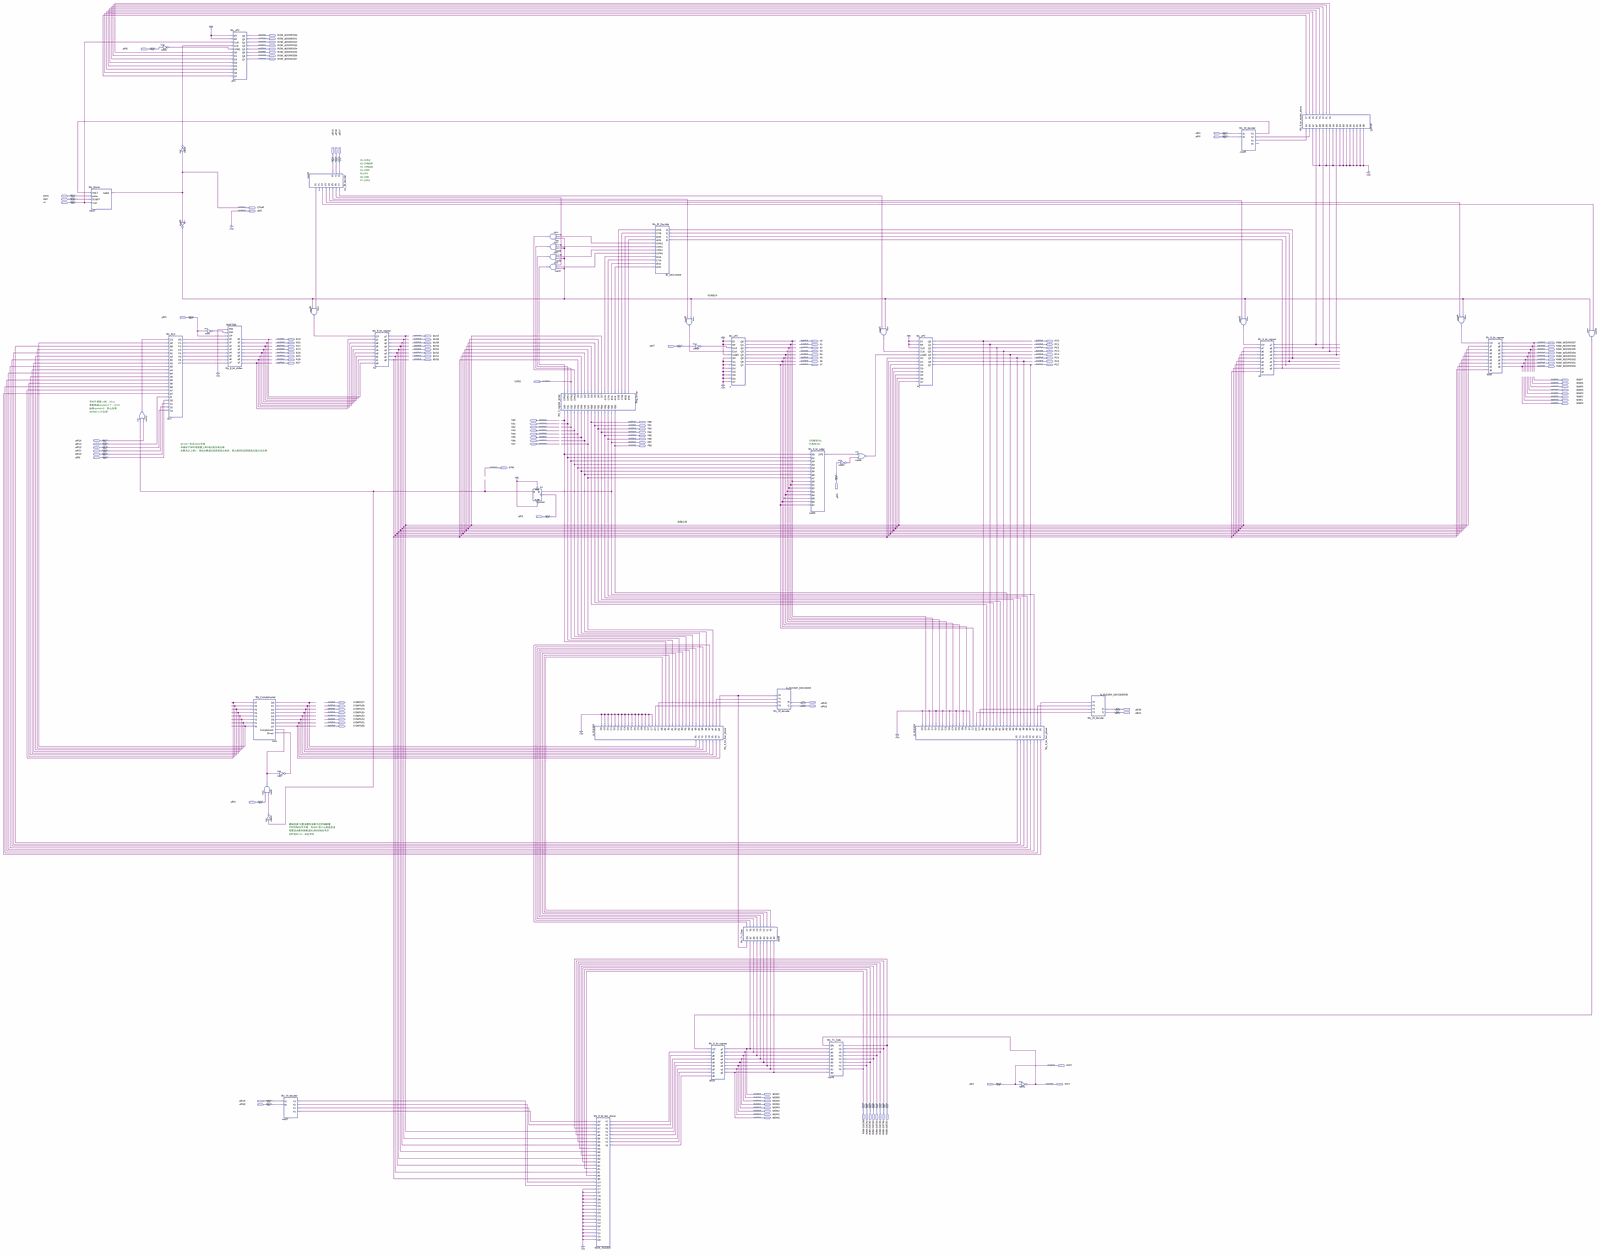
[diagram p0: schematic sheet, whole]
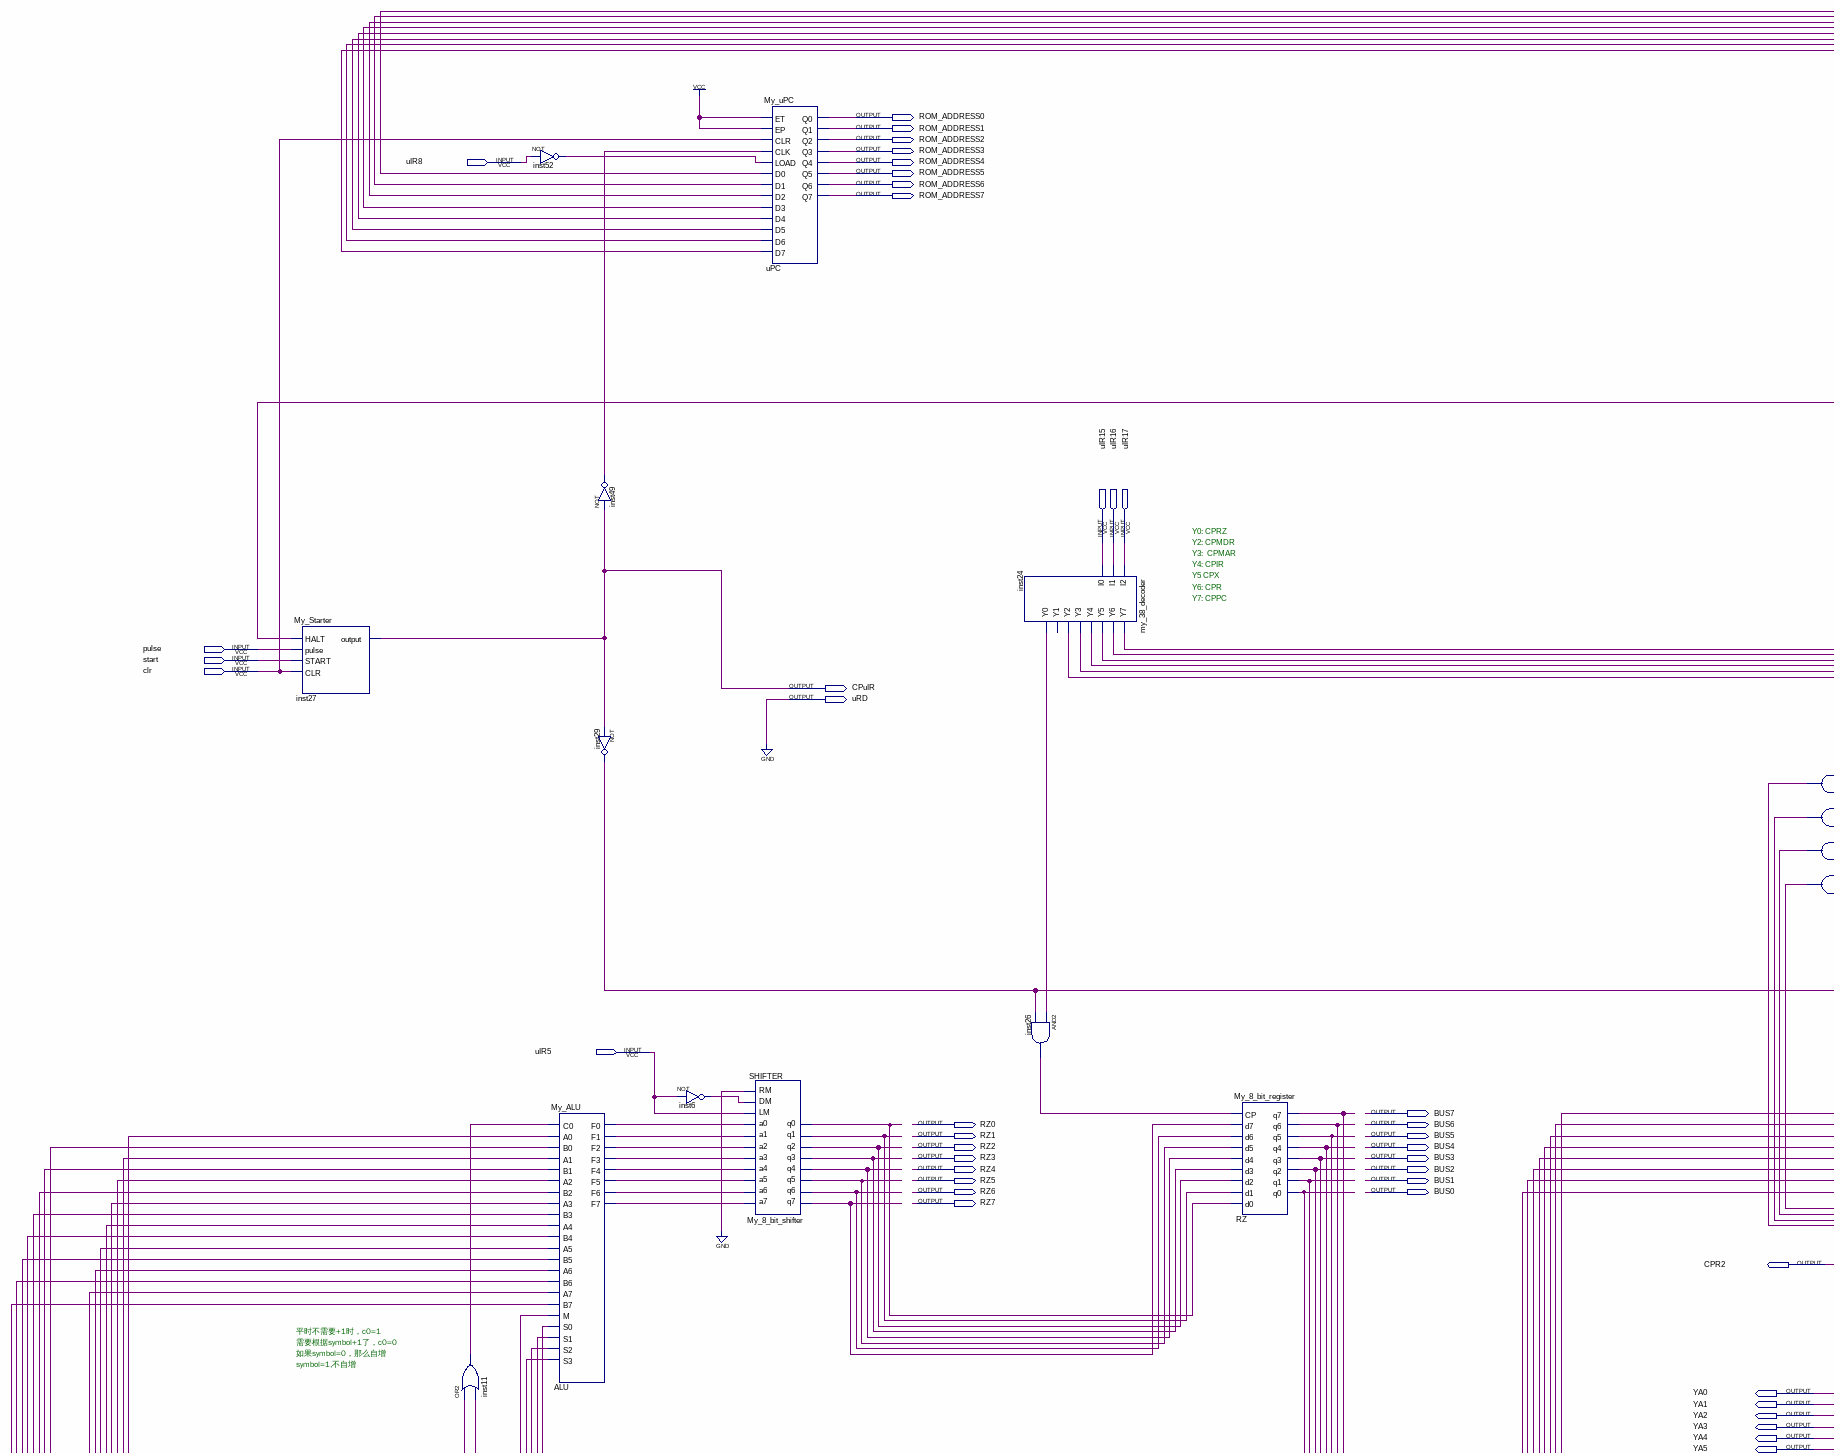
[diagram p1: schematic sheet, upper left part]
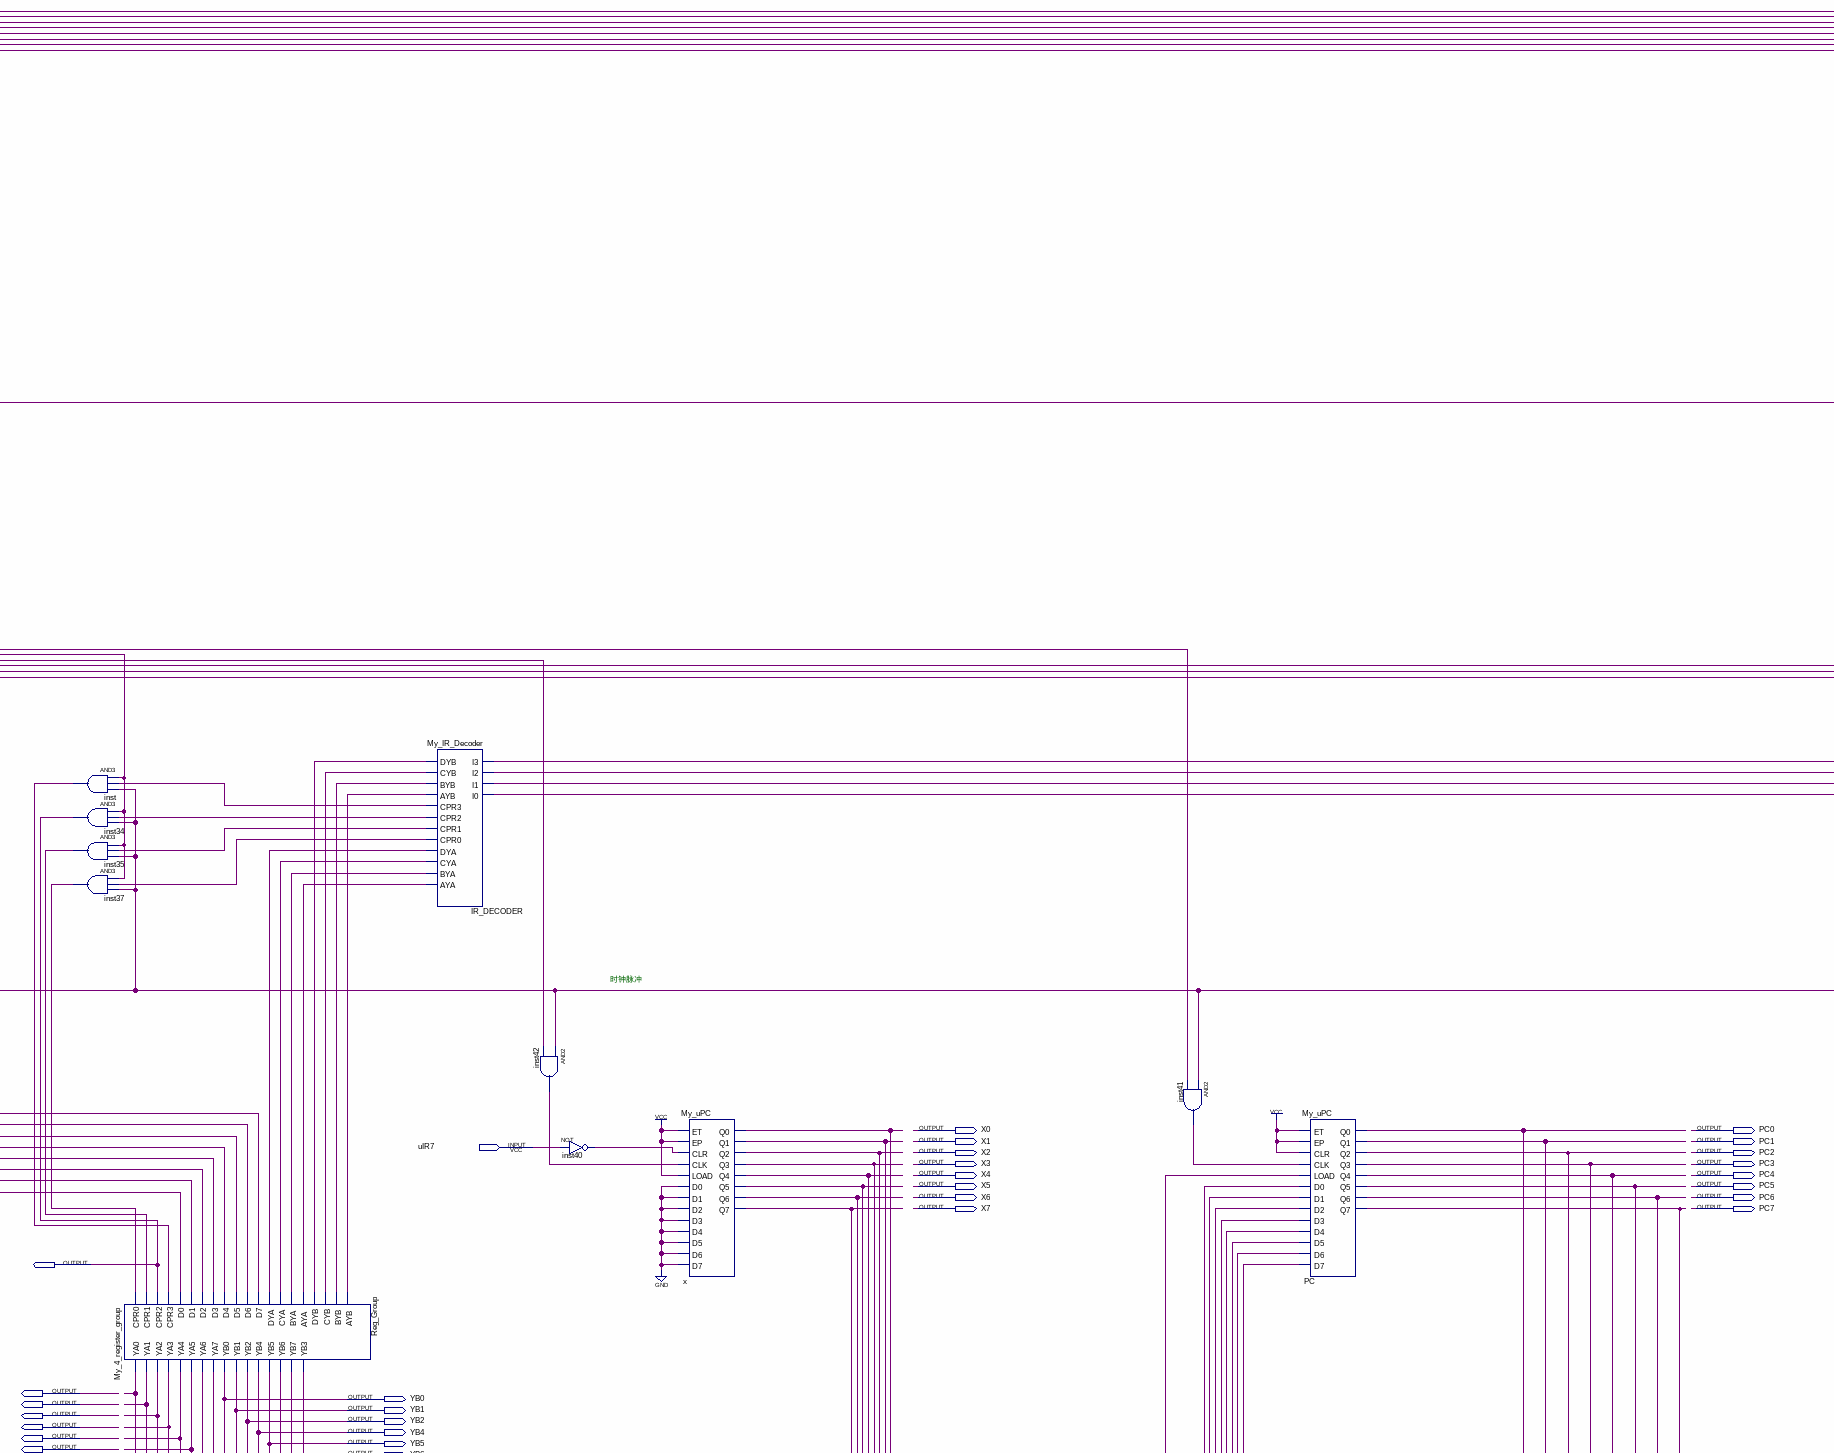
[diagram p2: schematic sheet, upper centre part]
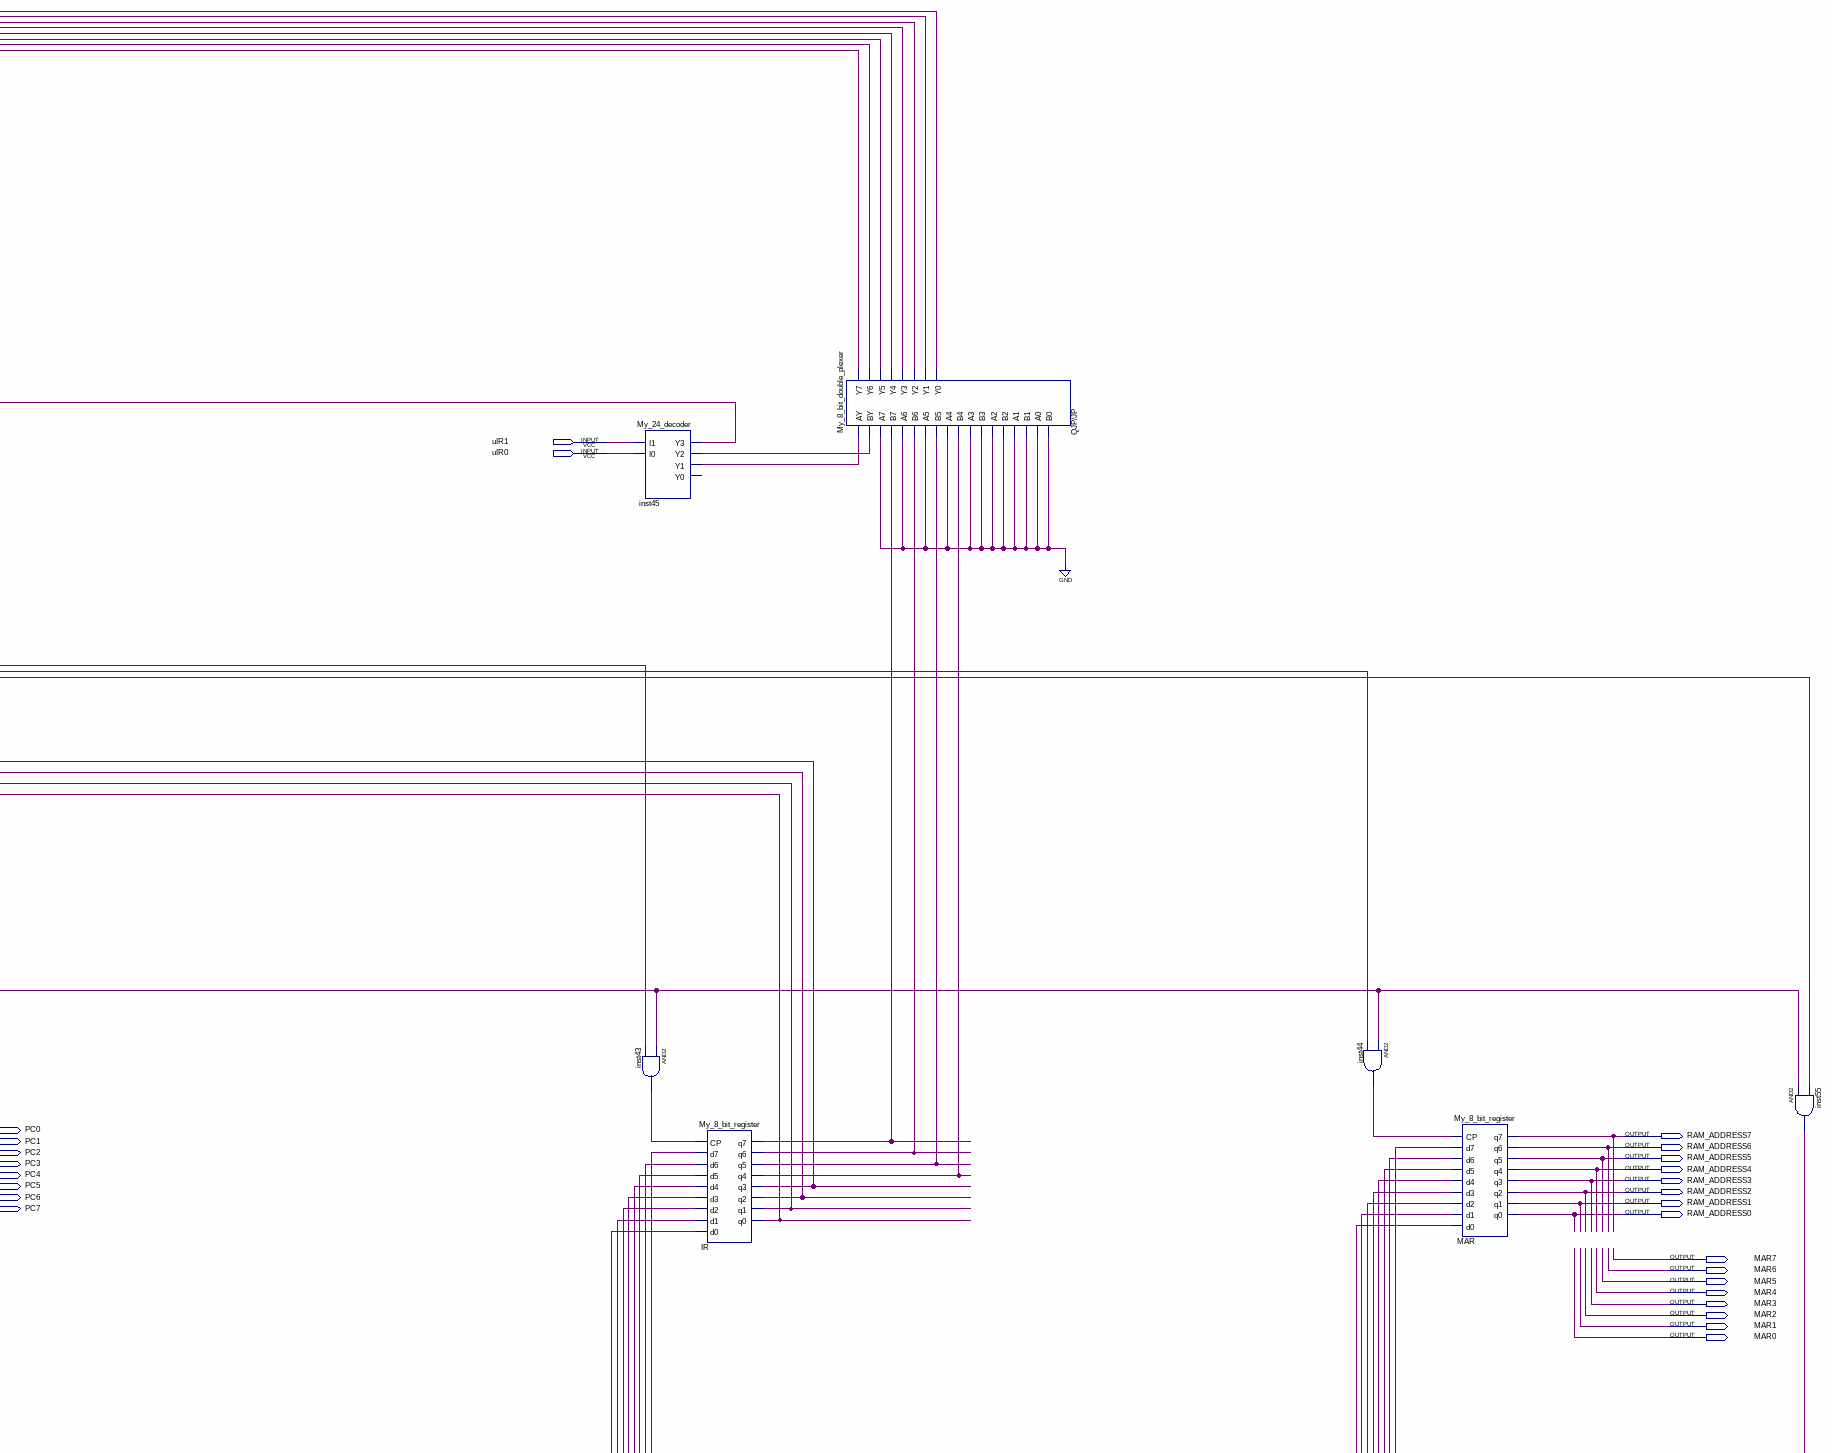
[diagram p3: schematic sheet, upper right part]
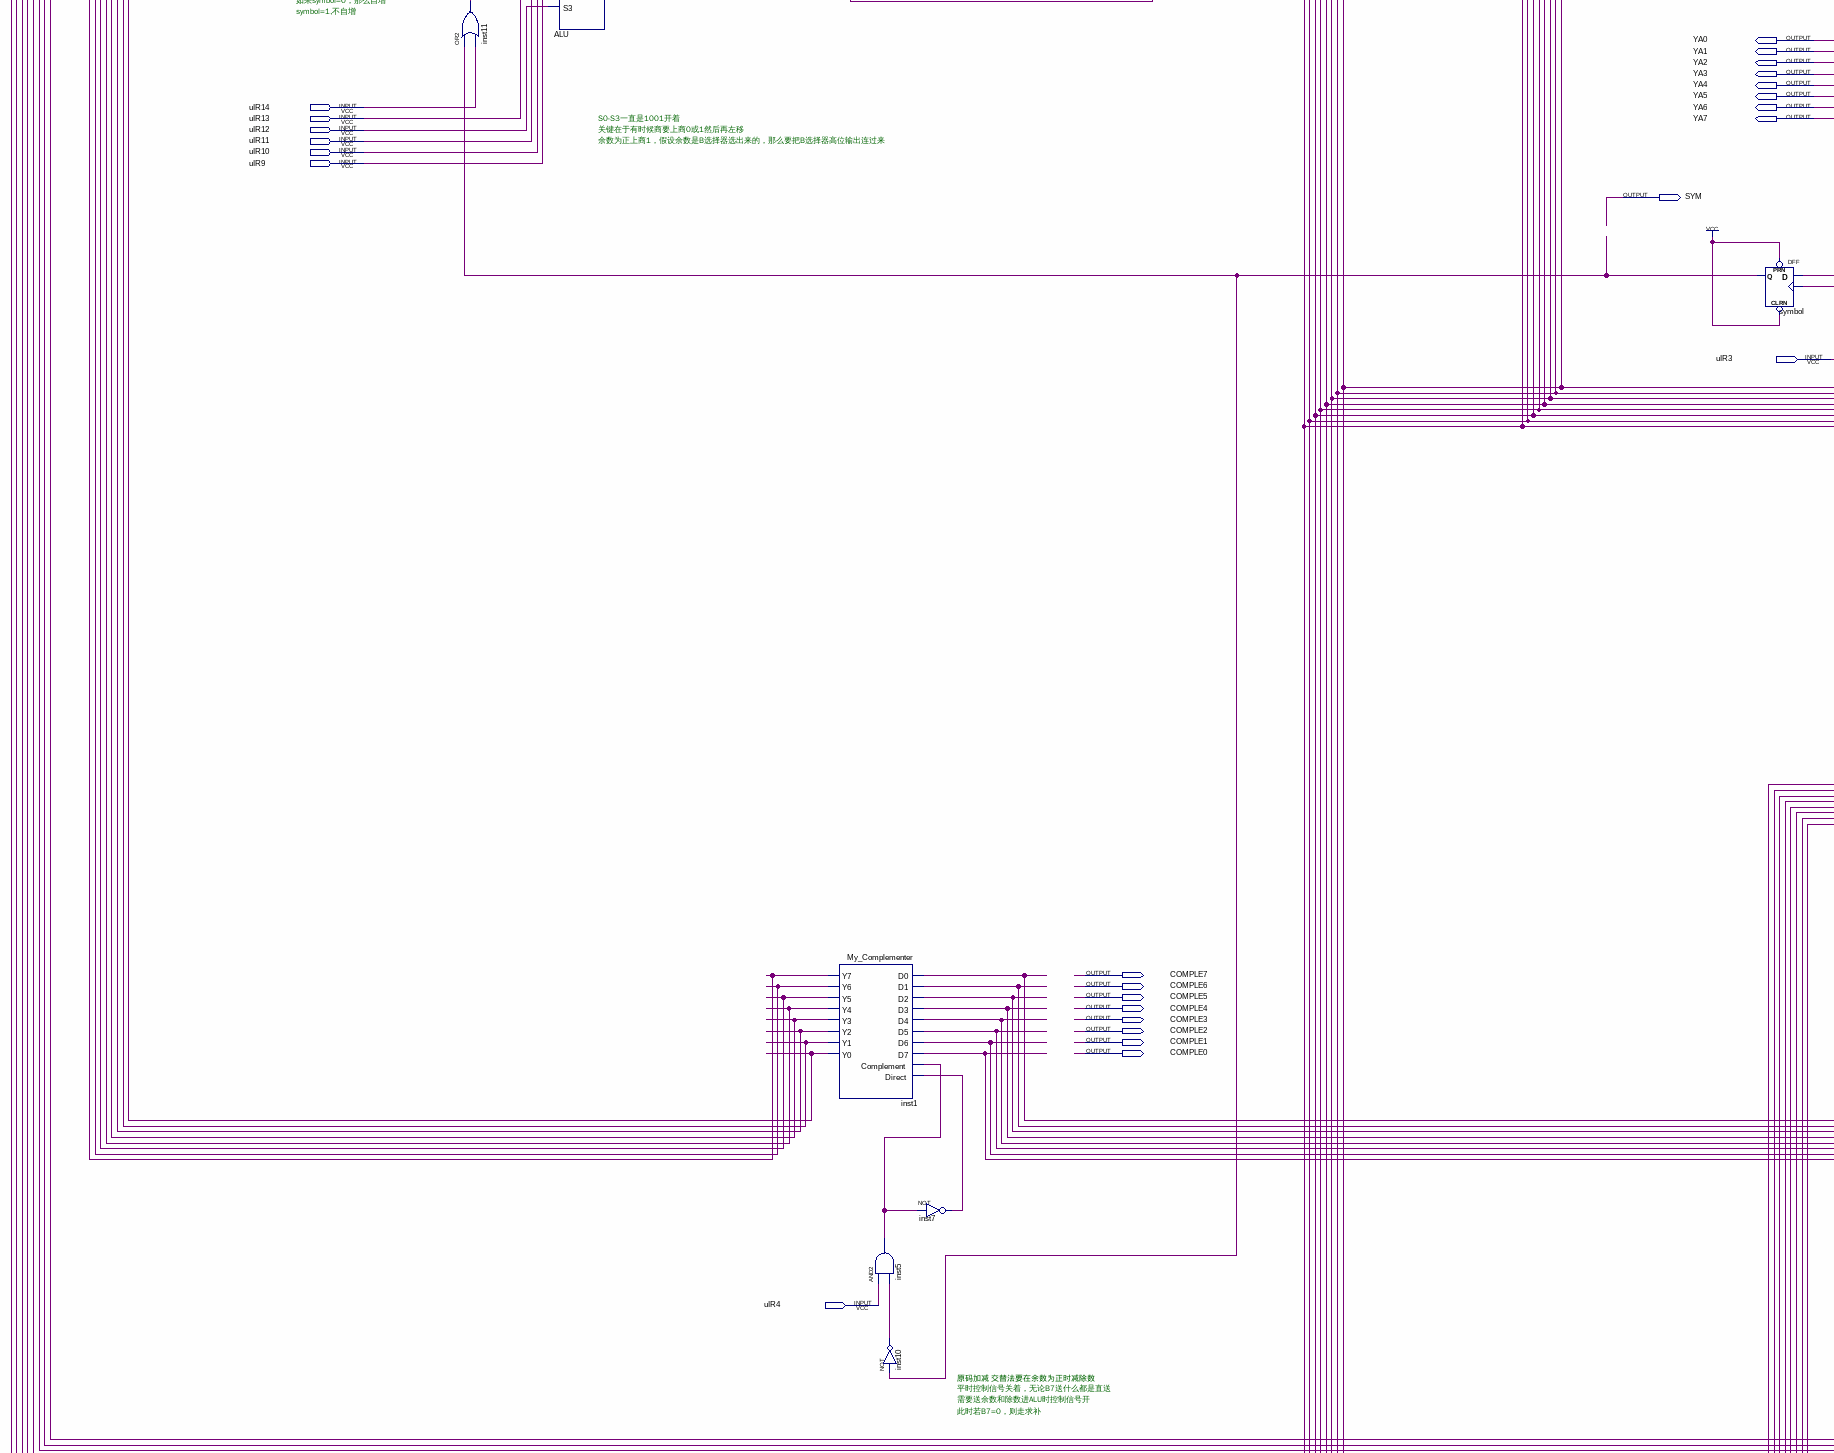
[diagram p4: schematic sheet, middle left part]
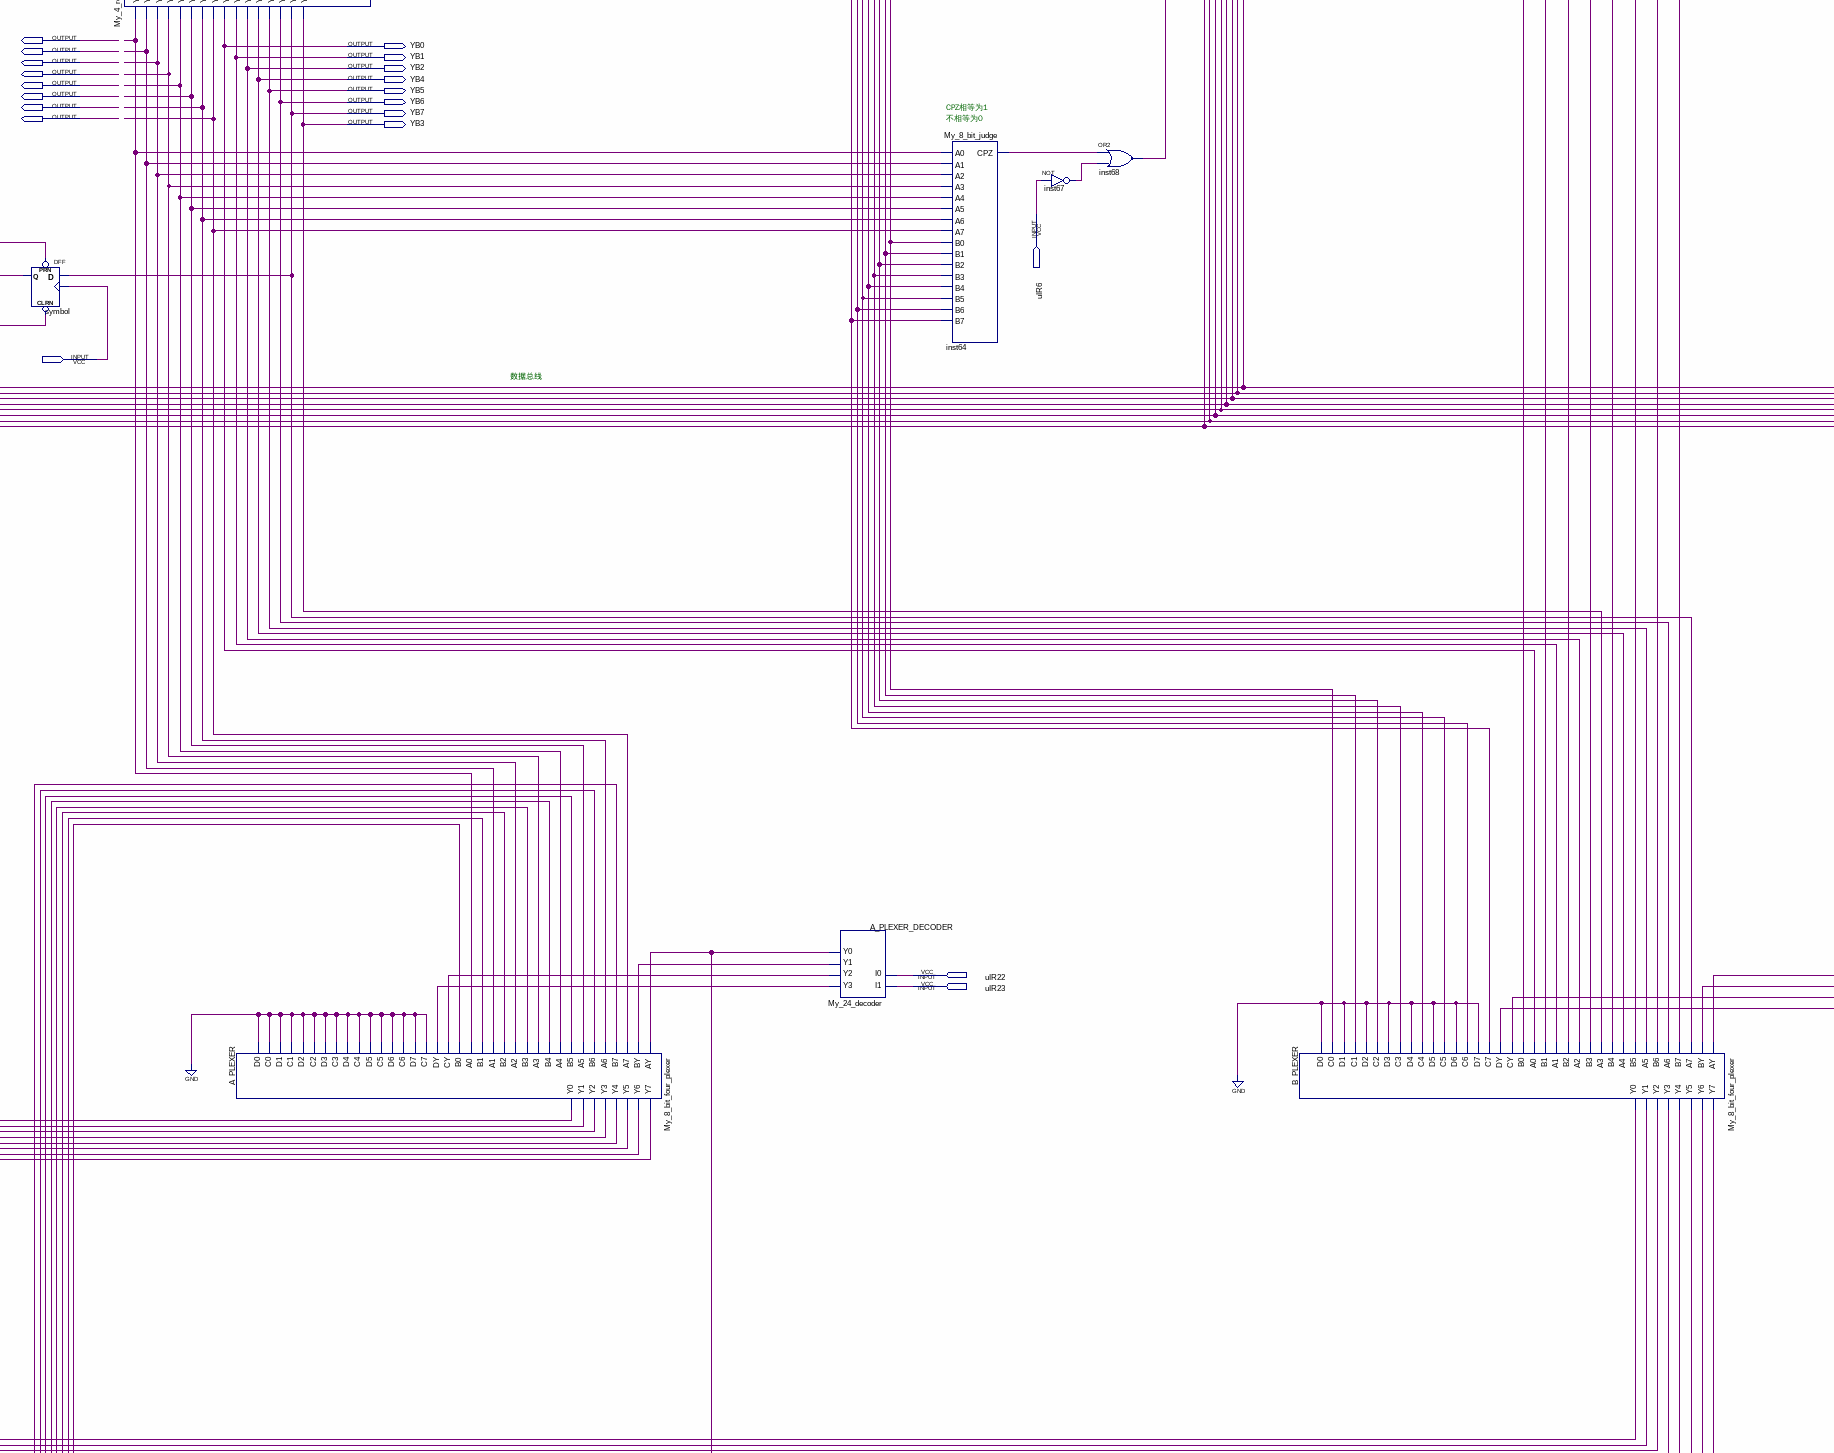
[diagram p5: schematic sheet, middle centre part]
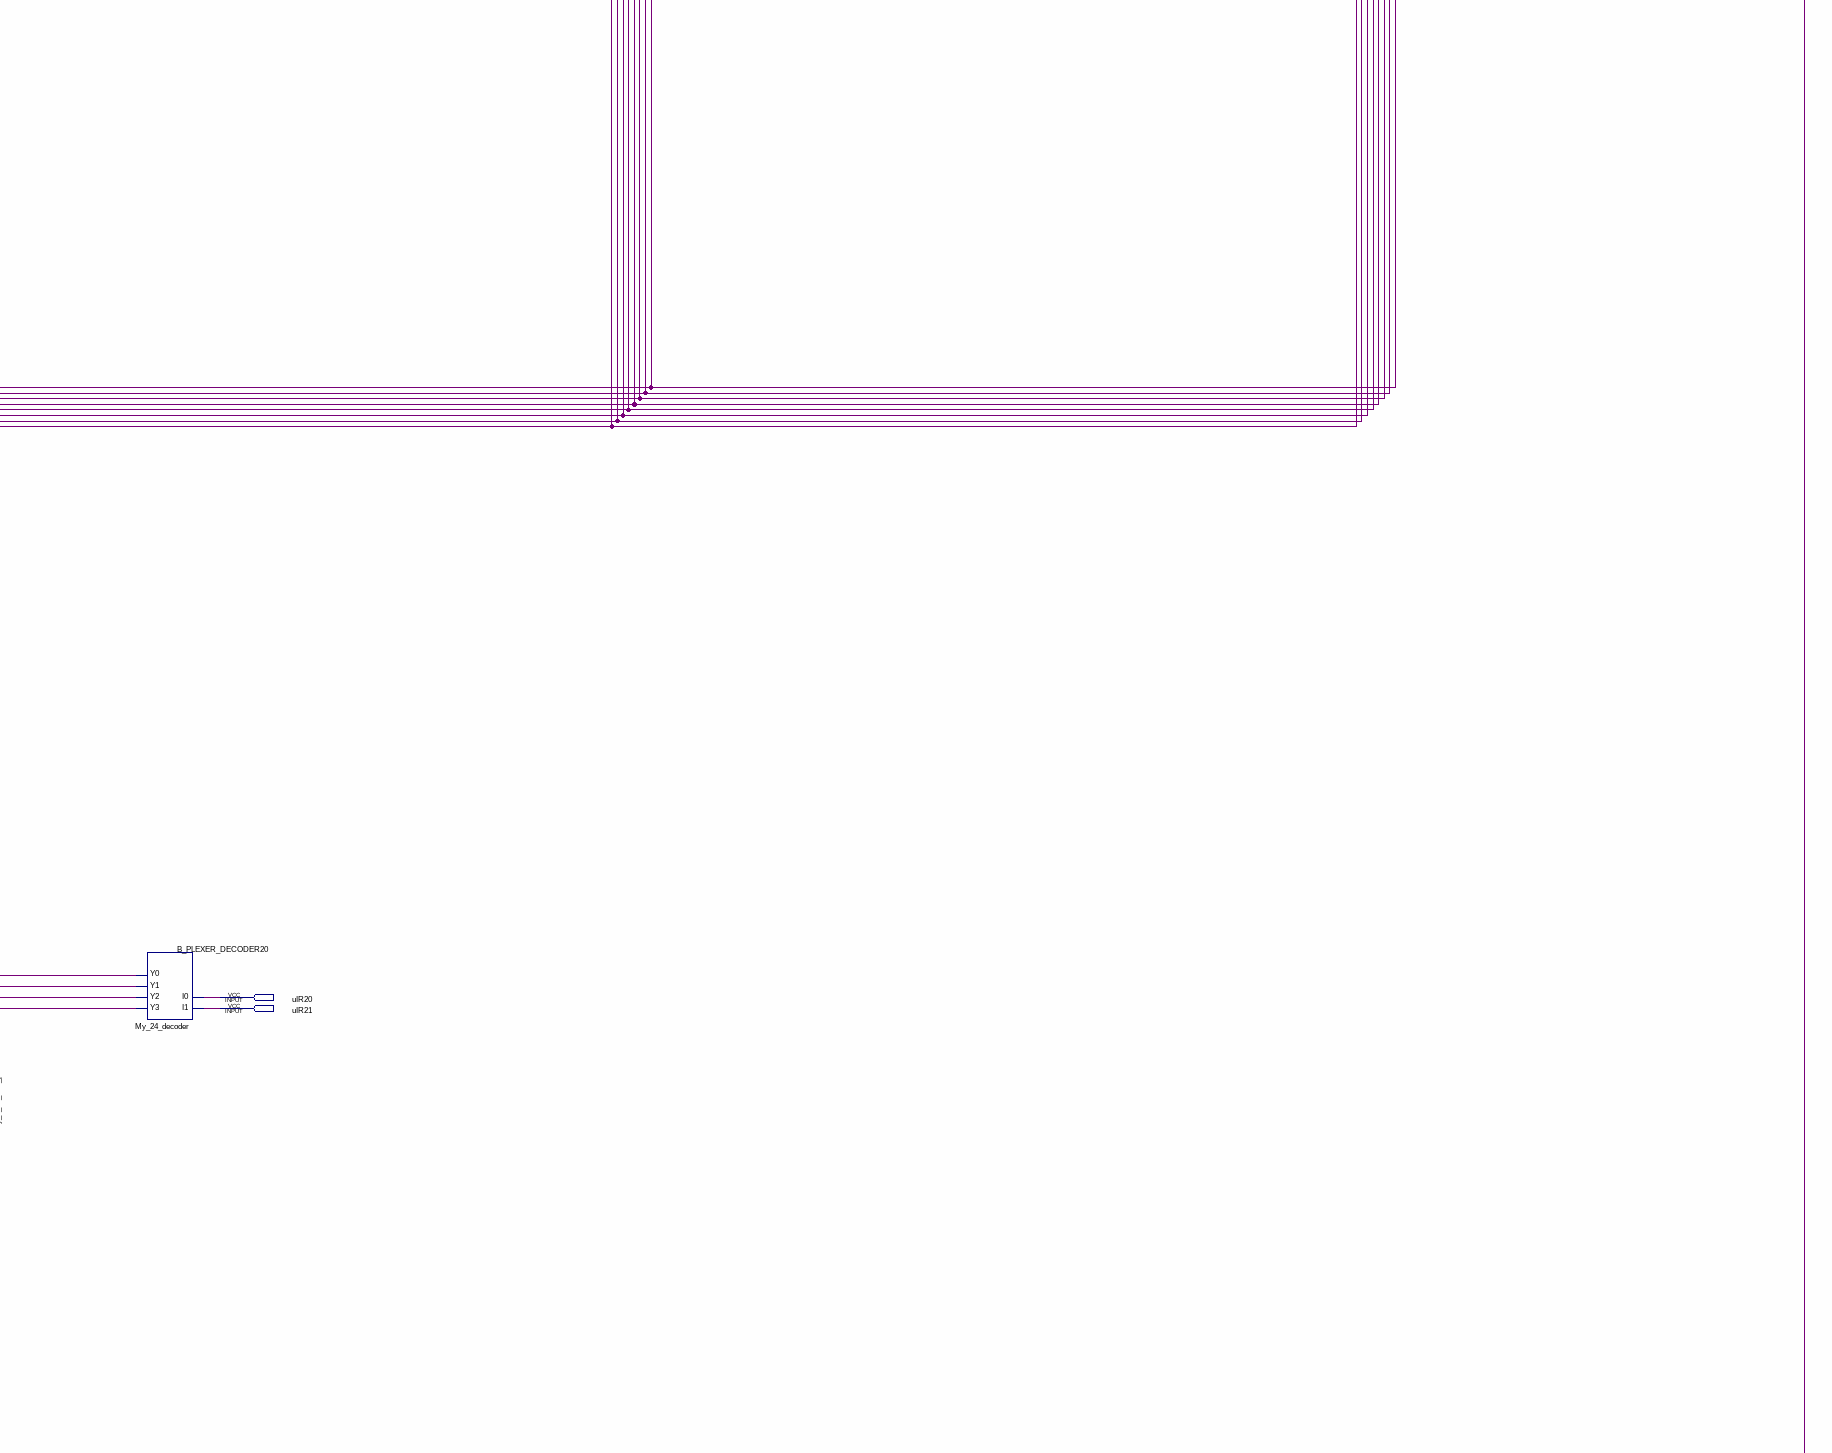
[diagram p6: schematic sheet, middle right part]
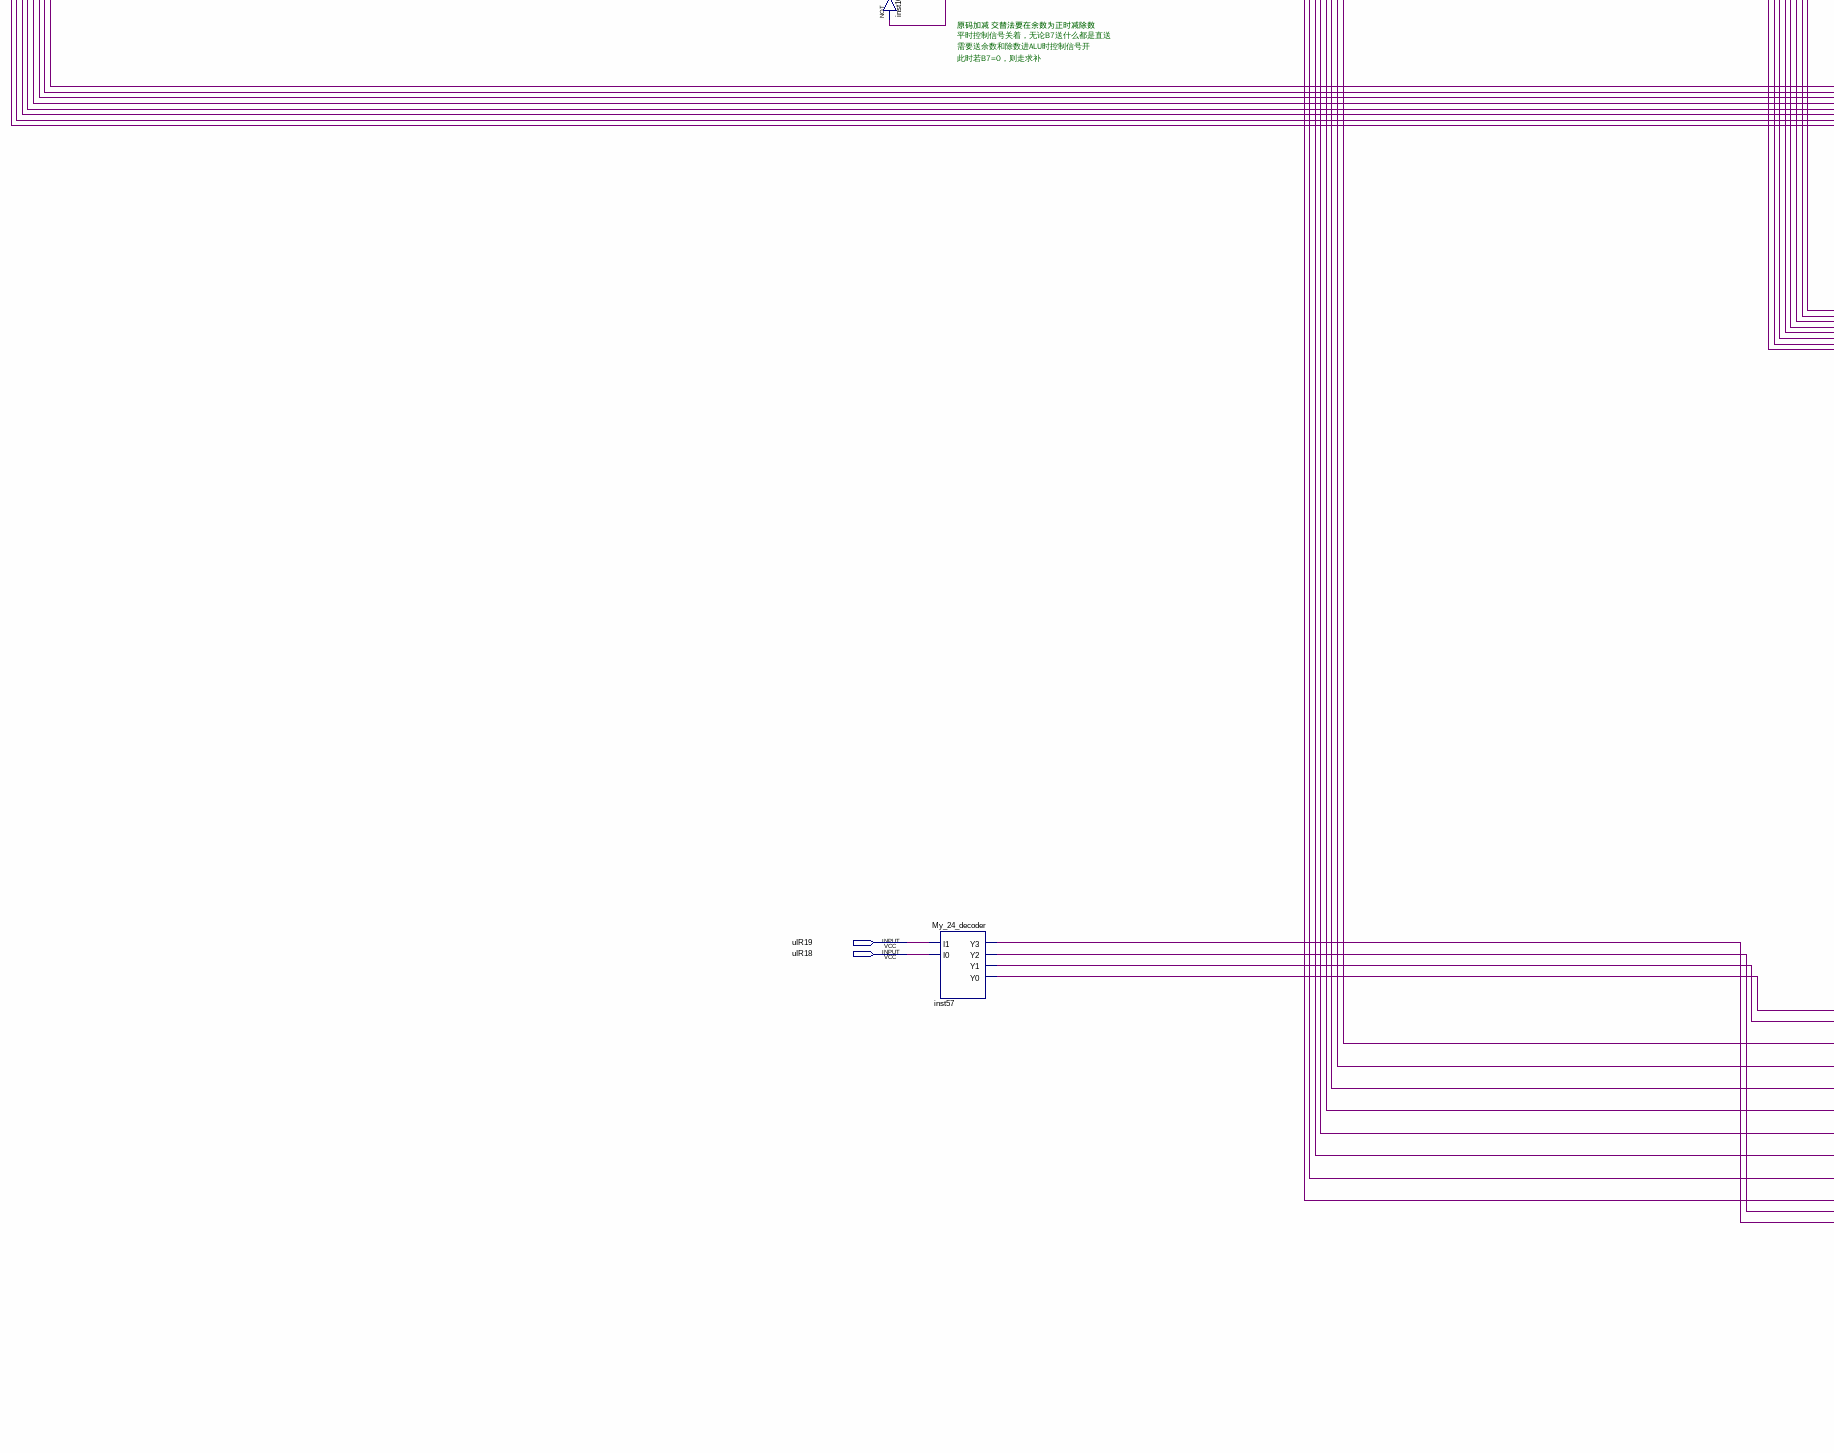
[diagram p7: schematic sheet, lower left part]
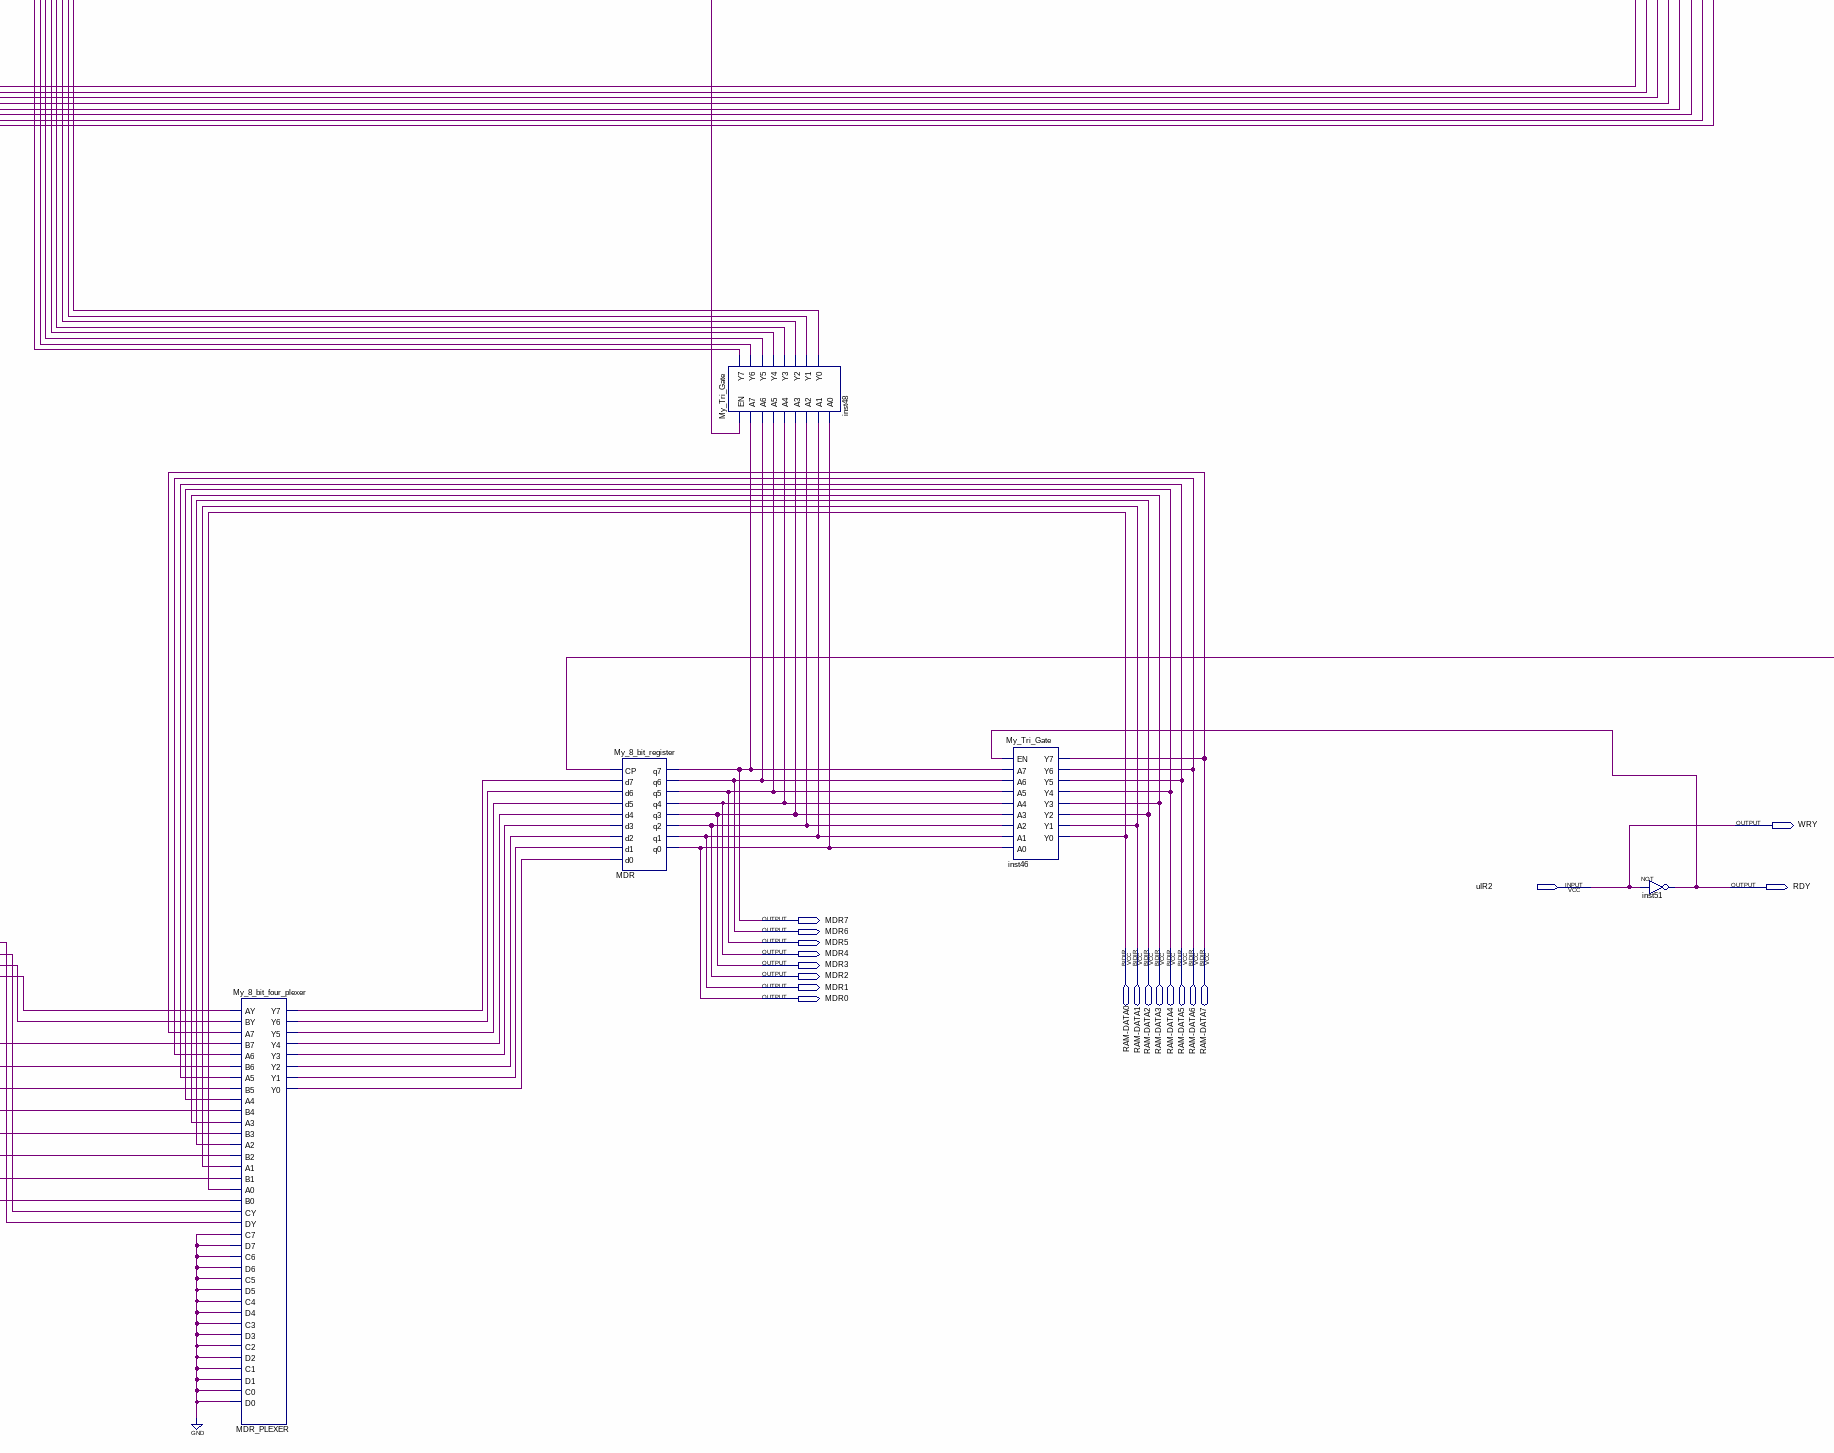
[diagram p8: schematic sheet, lower centre part]
// Quartus schematic My_Extende_Function_Level_Two_Overall_Design_5_2.bdf as structural Verilog: 48 symbols, 129 pins
module My_Extende_Function_Level_Two_Overall_Design_5_2 (
  input  uIR8,
  input  uIR1,
  input  uIR0,
  input  uIR15,
  input  uIR16,
  input  uIR17,
  input  pulse,
  input  start,
  input  clr,
  input  uIR5,
  input  uIR7,
  input  uIR14,
  input  uIR13,
  input  uIR12,
  input  uIR11,
  input  uIR10,
  input  uIR9,
  input  uIR6,
  input  uIR3,
  input  uIR22,
  input  uIR23,
  input  uIR20,
  input  uIR21,
  input  uIR4,
  input  uIR2,
  input  uIR19,
  input  uIR18,
  inout  \RAM-DATA0 ,
  inout  \RAM-DATA1 ,
  inout  \RAM-DATA2 ,
  inout  \RAM-DATA3 ,
  inout  \RAM-DATA4 ,
  inout  \RAM-DATA5 ,
  inout  \RAM-DATA6 ,
  inout  \RAM-DATA7 ,
  output ROM_ADDRESS0,
  output ROM_ADDRESS1,
  output ROM_ADDRESS2,
  output ROM_ADDRESS3,
  output ROM_ADDRESS4,
  output ROM_ADDRESS5,
  output ROM_ADDRESS6,
  output ROM_ADDRESS7,
  output CPuIR,
  output uRD,
  output BUS7,
  output RZ0,
  output BUS6,
  output X0,
  output PC0,
  output RZ1,
  output BUS5,
  output RAM_ADDRESS7,
  output X1,
  output PC1,
  output RZ2,
  output BUS4,
  output RAM_ADDRESS6,
  output X2,
  output PC2,
  output RZ3,
  output BUS3,
  output RAM_ADDRESS5,
  output X3,
  output PC3,
  output RZ4,
  output BUS2,
  output RAM_ADDRESS4,
  output X4,
  output PC4,
  output RZ5,
  output BUS1,
  output RAM_ADDRESS3,
  output X5,
  output PC5,
  output RZ6,
  output BUS0,
  output RAM_ADDRESS2,
  output X6,
  output PC6,
  output RZ7,
  output RAM_ADDRESS1,
  output X7,
  output PC7,
  output RAM_ADDRESS0,
  output MAR7,
  output CPR2,
  output MAR6,
  output MAR5,
  output MAR4,
  output MAR3,
  output MAR2,
  output MAR1,
  output MAR0,
  output YA0,
  output YB0,
  output YA1,
  output YB1,
  output YA2,
  output YB2,
  output YA3,
  output YB4,
  output YA4,
  output YB5,
  output YA5,
  output YB6,
  output YA6,
  output YB7,
  output YA7,
  output YB3,
  output SYM,
  output COMPLE7,
  output COMPLE6,
  output COMPLE5,
  output COMPLE4,
  output COMPLE3,
  output COMPLE2,
  output COMPLE1,
  output COMPLE0,
  output WRY,
  output RDY,
  output MDR7,
  output MDR6,
  output MDR5,
  output MDR4,
  output MDR3,
  output MDR2,
  output MDR1,
  output MDR0
);

  wire A_PLEXER_DECODER_y0, A_PLEXER_DECODER_y1, A_PLEXER_DECODER_y2, A_PLEXER_DECODER_y3, A_PLEXER_y0,
       A_PLEXER_y1, A_PLEXER_y2, A_PLEXER_y3, A_PLEXER_y4, A_PLEXER_y5, A_PLEXER_y6, A_PLEXER_y7, ALU_f0,
       ALU_f1, ALU_f2, ALU_f3, ALU_f4, ALU_f5, ALU_f6, ALU_f7, B_PLEXER_DECODER20_y0, B_PLEXER_DECODER20_y1,
       B_PLEXER_DECODER20_y2, B_PLEXER_DECODER20_y3, B_PLEXER_y0, B_PLEXER_y1, B_PLEXER_y2, B_PLEXER_y3,
       B_PLEXER_y4, B_PLEXER_y5, B_PLEXER_y6, B_PLEXER_y7, inst1_y0, inst1_y1, inst1_y2, inst1_y3, inst1_y4,
       inst1_y5, inst1_y6, inst1_y7, inst5_out, inst6_out, inst7_out, inst10_out, inst11_out, inst24_y0,
       inst24_y2, inst24_y3, inst24_y4, inst24_y5, inst24_y6, inst24_y7, inst26_out, inst29_out, inst35_out,
       inst37_out, inst40_out, inst41_out, inst42_out, inst43_out, inst44_out, inst45_y1, inst45_y2,
       inst45_y3, inst48_y0, inst48_y1, inst48_y2, inst48_y3, inst48_y4, inst48_y5, inst48_y6, inst48_y7,
       inst49_out, inst52_out, inst55_out, inst57_y0, inst57_y1, inst57_y2, inst57_y3, inst64_cpz,
       inst67_out, inst68_out, inst_out, IR_DECODER_aya, IR_DECODER_ayb, IR_DECODER_bya, IR_DECODER_byb,
       IR_DECODER_cpr0, IR_DECODER_cpr1, IR_DECODER_cpr2, IR_DECODER_cpr3, IR_DECODER_cya, IR_DECODER_cyb,
       IR_DECODER_dya, IR_DECODER_dyb, IR_q0, IR_q1, IR_q2, IR_q3, IR_q4, IR_q5, IR_q6, IR_q7, MDR_PLEXER_y0,
       MDR_PLEXER_y1, MDR_PLEXER_y2, MDR_PLEXER_y3, MDR_PLEXER_y4, MDR_PLEXER_y5, MDR_PLEXER_y6,
       MDR_PLEXER_y7, PC_q0, PC_q1, PC_q2, PC_q3, PC_q4, PC_q5, PC_q6, PC_q7, QJP_JP_y0, QJP_JP_y1,
       QJP_JP_y2, QJP_JP_y3, QJP_JP_y4, QJP_JP_y5, QJP_JP_y6, QJP_JP_y7, Reg_Group_ya0, Reg_Group_ya1,
       Reg_Group_ya2, Reg_Group_ya3, Reg_Group_ya4, Reg_Group_ya5, Reg_Group_ya6, Reg_Group_ya7, RZ_q0,
       RZ_q1, RZ_q2, RZ_q3, RZ_q4, RZ_q5, RZ_q6, RZ_q7, SHIFTER_q0, SHIFTER_q1, SHIFTER_q2, SHIFTER_q3,
       SHIFTER_q4, SHIFTER_q5, SHIFTER_q6, SHIFTER_q7, symbol_q, x_q0, x_q1, x_q2, x_q3, x_q4, x_q5, x_q6,
       x_q7;

  My_Starter inst27 (.HALT(inst45_y3), .pulse(pulse), .START(start), .CLR(clr), .\output (CPuIR));
  or inst11 (inst11_out, symbol_q, uIR14);
  not inst52 (inst52_out, uIR8);
  My_ALU ALU (
    .C0(inst11_out), .A0(inst1_y0), .B0(B_PLEXER_y0), .A1(inst1_y1), .B1(B_PLEXER_y1), .A2(inst1_y2),
    .B2(B_PLEXER_y2), .A3(inst1_y3), .B3(B_PLEXER_y3), .A4(inst1_y4), .B4(B_PLEXER_y4), .A5(inst1_y5),
    .B5(B_PLEXER_y5), .A6(inst1_y6), .B6(B_PLEXER_y6), .A7(inst1_y7), .B7(B_PLEXER_y7), .M(uIR13), .S0(uIR9),
    .S1(uIR10), .S2(uIR11), .S3(uIR12), .F0(ALU_f0), .F1(ALU_f1), .F2(ALU_f2), .F3(ALU_f3), .F4(ALU_f4),
    .F5(ALU_f5), .F6(ALU_f6), .F7(ALU_f7));
  not inst49 (inst49_out, CPuIR);
  not inst29 (inst29_out, CPuIR);
  not inst6 (inst6_out, uIR5);
  My_8_bit_shifter SHIFTER (
    .a7(ALU_f7), .a6(ALU_f6), .a5(ALU_f5), .a4(ALU_f4), .a3(ALU_f3), .a2(ALU_f2), .a1(ALU_f1), .a0(ALU_f0),
    .LM(uIR5), .DM(inst6_out), .RM(1'b0), .q7(SHIFTER_q7), .q6(SHIFTER_q6), .q5(SHIFTER_q5), .q4(SHIFTER_q4),
    .q3(SHIFTER_q3), .q2(SHIFTER_q2), .q1(SHIFTER_q1), .q0(SHIFTER_q0));
  My_uPC uPC (
    .ET(1'b1), .EP(1'b1), .CLR(clr), .CLK(inst49_out), .LOAD(inst52_out), .D0(QJP_JP_y0), .D1(QJP_JP_y1),
    .D2(QJP_JP_y2), .D3(QJP_JP_y3), .D4(QJP_JP_y4), .D5(QJP_JP_y5), .D6(QJP_JP_y6), .D7(QJP_JP_y7),
    .Q0(ROM_ADDRESS0), .Q1(ROM_ADDRESS1), .Q2(ROM_ADDRESS2), .Q3(ROM_ADDRESS3), .Q4(ROM_ADDRESS4),
    .Q5(ROM_ADDRESS5), .Q6(ROM_ADDRESS6), .Q7(ROM_ADDRESS7));
  My_Complementer inst1 (
    .D0(A_PLEXER_y0), .D1(A_PLEXER_y1), .D2(A_PLEXER_y2), .D3(A_PLEXER_y3), .D4(A_PLEXER_y4),
    .D5(A_PLEXER_y5), .D6(A_PLEXER_y6), .D7(A_PLEXER_y7), .Complement(inst5_out), .Direct(inst7_out),
    .Y7(inst1_y7), .Y6(inst1_y6), .Y5(inst1_y5), .Y4(inst1_y4), .Y3(inst1_y3), .Y2(inst1_y2), .Y1(inst1_y1),
    .Y0(inst1_y0));
  and inst5 (inst5_out, uIR4, inst10_out);
  not inst10 (inst10_out, symbol_q);
  not inst7 (inst7_out, inst5_out);
  My_24_decoder inst57 (.I1(uIR19), .I0(uIR18), .Y3(inst57_y3), .Y2(inst57_y2), .Y1(inst57_y1), .Y0(inst57_y0));
  my_38_decoder inst24 (
    .I2(uIR17), .I1(uIR16), .I0(uIR15), .Y7(inst24_y7), .Y6(inst24_y6), .Y5(inst24_y5), .Y4(inst24_y4),
    .Y3(inst24_y3), .Y2(inst24_y2), .Y0(inst24_y0));  // open: Y1
  and inst26 (inst26_out, inst24_y0, inst29_out);
  My_8_bit_register RZ (
    .CP(inst26_out), .d7(SHIFTER_q7), .d6(SHIFTER_q6), .d5(SHIFTER_q5), .d4(SHIFTER_q4), .d3(SHIFTER_q3),
    .d2(SHIFTER_q2), .d1(SHIFTER_q1), .d0(SHIFTER_q0), .q7(RZ_q7), .q6(RZ_q6), .q5(RZ_q5), .q4(RZ_q4),
    .q3(RZ_q3), .q2(RZ_q2), .q1(RZ_q1), .q0(RZ_q0));
  DFF symbol (.CLRN(1'b1), .CLK(uIR3), .D(YB7), .PRN(1'b1), .Q(symbol_q));
  and inst (inst_out, inst24_y6, IR_DECODER_cpr3, inst29_out);
  and inst34 (CPR2, inst24_y6, IR_DECODER_cpr2, inst29_out);
  and inst35 (inst35_out, inst24_y6, IR_DECODER_cpr1, inst29_out);
  and inst37 (inst37_out, inst24_y6, IR_DECODER_cpr0, inst29_out);
  My_4_register_group Reg_Group (
    .CPR0(inst37_out), .CPR1(inst35_out), .CPR2(CPR2), .CPR3(inst_out), .D0(RZ_q0), .D1(RZ_q1), .D2(RZ_q2),
    .D3(RZ_q3), .D4(RZ_q4), .D5(RZ_q5), .D6(RZ_q6), .D7(RZ_q7), .DYA(IR_DECODER_dya), .CYA(IR_DECODER_cya),
    .BYA(IR_DECODER_bya), .AYA(IR_DECODER_aya), .DYB(IR_DECODER_dyb), .CYB(IR_DECODER_cyb),
    .BYB(IR_DECODER_byb), .AYB(IR_DECODER_ayb), .YA0(Reg_Group_ya0), .YA1(Reg_Group_ya1),
    .YA2(Reg_Group_ya2), .YA3(Reg_Group_ya3), .YA4(Reg_Group_ya4), .YA5(Reg_Group_ya5), .YA6(Reg_Group_ya6),
    .YA7(Reg_Group_ya7), .YB0(YB0), .YB1(YB1), .YB2(YB2), .YB4(YB4), .YB5(YB5), .YB6(YB6), .YB7(YB7),
    .YB3(YB3));
  My_8_bit_four_plexer A_PLEXER (
    .AY(A_PLEXER_DECODER_y0), .BY(A_PLEXER_DECODER_y1), .A7(Reg_Group_ya7), .B7(inst48_y7),
    .A6(Reg_Group_ya6), .B6(inst48_y6), .A5(Reg_Group_ya5), .B5(inst48_y5), .A4(Reg_Group_ya4),
    .B4(inst48_y4), .A3(Reg_Group_ya3), .B3(inst48_y3), .A2(Reg_Group_ya2), .B2(inst48_y2),
    .A1(Reg_Group_ya1), .B1(inst48_y1), .A0(Reg_Group_ya0), .B0(inst48_y0), .CY(A_PLEXER_DECODER_y2),
    .DY(A_PLEXER_DECODER_y3), .C7(1'b0), .D7(1'b0), .C6(1'b0), .D6(1'b0), .C5(1'b0), .D5(1'b0), .C4(1'b0),
    .D4(1'b0), .C3(1'b0), .D3(1'b0), .C2(1'b0), .D2(1'b0), .C1(1'b0), .D1(1'b0), .C0(1'b0), .D0(1'b0),
    .Y7(A_PLEXER_y7), .Y6(A_PLEXER_y6), .Y5(A_PLEXER_y5), .Y4(A_PLEXER_y4), .Y3(A_PLEXER_y3),
    .Y2(A_PLEXER_y2), .Y1(A_PLEXER_y1), .Y0(A_PLEXER_y0));
  My_8_bit_four_plexer MDR_PLEXER (
    .AY(inst57_y0), .BY(inst57_y1), .A7(\RAM-DATA7 ), .B7(RZ_q7), .A6(\RAM-DATA6 ), .B6(RZ_q6),
    .A5(\RAM-DATA5 ), .B5(RZ_q5), .A4(\RAM-DATA4 ), .B4(RZ_q4), .A3(\RAM-DATA3 ), .B3(RZ_q3),
    .A2(\RAM-DATA2 ), .B2(RZ_q2), .A1(\RAM-DATA1 ), .B1(RZ_q1), .A0(\RAM-DATA0 ), .B0(RZ_q0), .CY(inst57_y2),
    .DY(inst57_y3), .C7(1'b0), .D7(1'b0), .C6(1'b0), .D6(1'b0), .C5(1'b0), .D5(1'b0), .C4(1'b0), .D4(1'b0),
    .C3(1'b0), .D3(1'b0), .C2(1'b0), .D2(1'b0), .C1(1'b0), .D1(1'b0), .C0(1'b0), .D0(1'b0),
    .Y7(MDR_PLEXER_y7), .Y6(MDR_PLEXER_y6), .Y5(MDR_PLEXER_y5), .Y4(MDR_PLEXER_y4), .Y3(MDR_PLEXER_y3),
    .Y2(MDR_PLEXER_y2), .Y1(MDR_PLEXER_y1), .Y0(MDR_PLEXER_y0));
  My_IR_Decoder IR_DECODER (
    .I3(IR_q3), .I2(IR_q2), .I1(IR_q1), .I0(IR_q0), .DYB(IR_DECODER_dyb), .CYB(IR_DECODER_cyb),
    .BYB(IR_DECODER_byb), .AYB(IR_DECODER_ayb), .CPR3(IR_DECODER_cpr3), .CPR2(IR_DECODER_cpr2),
    .CPR1(IR_DECODER_cpr1), .CPR0(IR_DECODER_cpr0), .DYA(IR_DECODER_dya), .CYA(IR_DECODER_cya),
    .BYA(IR_DECODER_bya), .AYA(IR_DECODER_aya));
  and inst42 (inst42_out, inst29_out, inst24_y5);
  not inst40 (inst40_out, uIR7);
  My_8_bit_register MDR (
    .CP(inst55_out), .d7(MDR_PLEXER_y7), .d6(MDR_PLEXER_y6), .d5(MDR_PLEXER_y5), .d4(MDR_PLEXER_y4),
    .d3(MDR_PLEXER_y3), .d2(MDR_PLEXER_y2), .d1(MDR_PLEXER_y1), .d0(MDR_PLEXER_y0), .q7(MDR7), .q6(MDR6),
    .q5(MDR5), .q4(MDR4), .q3(MDR3), .q2(MDR2), .q1(MDR1), .q0(MDR0));
  My_uPC x (
    .ET(1'b1), .EP(1'b1), .CLR(inst40_out), .CLK(inst42_out), .LOAD(1'b1), .D0(1'b0), .D1(1'b0), .D2(1'b0),
    .D3(1'b0), .D4(1'b0), .D5(1'b0), .D6(1'b0), .D7(1'b0), .Q0(x_q0), .Q1(x_q1), .Q2(x_q2), .Q3(x_q3),
    .Q4(x_q4), .Q5(x_q5), .Q6(x_q6), .Q7(x_q7));
  My_Tri_Gate inst48 (
    .EN(A_PLEXER_DECODER_y0), .A7(MDR7), .A6(MDR6), .A5(MDR5), .A4(MDR4), .A3(MDR3), .A2(MDR2), .A1(MDR1),
    .A0(MDR0), .Y7(inst48_y7), .Y6(inst48_y6), .Y5(inst48_y5), .Y4(inst48_y4), .Y3(inst48_y3),
    .Y2(inst48_y2), .Y1(inst48_y1), .Y0(inst48_y0));
  My_24_decoder A_PLEXER_DECODER (
    .I1(uIR23), .I0(uIR22), .Y3(A_PLEXER_DECODER_y3), .Y2(A_PLEXER_DECODER_y2), .Y1(A_PLEXER_DECODER_y1),
    .Y0(A_PLEXER_DECODER_y0));
  My_8_bit_judge inst64 (
    .A0(Reg_Group_ya0), .A1(Reg_Group_ya1), .A2(Reg_Group_ya2), .A3(Reg_Group_ya3), .A4(Reg_Group_ya4),
    .A5(Reg_Group_ya5), .A6(Reg_Group_ya6), .A7(Reg_Group_ya7), .B0(x_q0), .B1(x_q1), .B2(x_q2), .B3(x_q3),
    .B4(x_q4), .B5(x_q5), .B6(x_q6), .B7(x_q7), .CPZ(inst64_cpz));
  My_Tri_Gate inst46 (
    .EN(RDY), .A7(MDR7), .A6(MDR6), .A5(MDR5), .A4(MDR4), .A3(MDR3), .A2(MDR2), .A1(MDR1), .A0(MDR0),
    .Y7(\RAM-DATA7 ), .Y6(\RAM-DATA6 ), .Y5(\RAM-DATA5 ), .Y4(\RAM-DATA4 ), .Y3(\RAM-DATA3 ),
    .Y2(\RAM-DATA2 ), .Y1(\RAM-DATA1 ), .Y0(\RAM-DATA0 ));
  not inst67 (inst67_out, uIR6);
  or inst68 (inst68_out, inst64_cpz, inst67_out);
  and inst41 (inst41_out, inst29_out, inst24_y7);
  My_uPC PC (
    .ET(1'b1), .EP(1'b1), .CLR(1'b1), .CLK(inst41_out), .LOAD(inst68_out), .D0(RZ_q0), .D1(RZ_q1),
    .D2(RZ_q2), .D3(RZ_q3), .D4(RZ_q4), .D5(RZ_q5), .D6(RZ_q6), .D7(RZ_q7), .Q0(PC_q0), .Q1(PC_q1),
    .Q2(PC_q2), .Q3(PC_q3), .Q4(PC_q4), .Q5(PC_q5), .Q6(PC_q6), .Q7(PC_q7));
  My_8_bit_four_plexer B_PLEXER (
    .AY(B_PLEXER_DECODER20_y0), .BY(B_PLEXER_DECODER20_y1), .A7(YB7), .B7(PC_q7), .A6(YB6), .B6(PC_q6),
    .A5(YB5), .B5(PC_q5), .A4(YB4), .B4(PC_q4), .A3(YB3), .B3(PC_q3), .A2(YB2), .B2(PC_q2), .A1(YB1),
    .B1(PC_q1), .A0(YB0), .B0(PC_q0), .CY(B_PLEXER_DECODER20_y2), .DY(B_PLEXER_DECODER20_y3), .C7(x_q7),
    .D7(1'b0), .C6(x_q6), .D6(1'b0), .C5(x_q5), .D5(1'b0), .C4(x_q4), .D4(1'b0), .C3(x_q3), .D3(1'b0),
    .C2(x_q2), .D2(1'b0), .C1(x_q1), .D1(1'b0), .C0(x_q0), .D0(1'b0), .Y7(B_PLEXER_y7), .Y6(B_PLEXER_y6),
    .Y5(B_PLEXER_y5), .Y4(B_PLEXER_y4), .Y3(B_PLEXER_y3), .Y2(B_PLEXER_y2), .Y1(B_PLEXER_y1), .Y0(B_PLEXER_y0));
  not inst51 (RDY, uIR2);
  My_24_decoder B_PLEXER_DECODER20 (
    .I1(uIR21), .I0(uIR20), .Y3(B_PLEXER_DECODER20_y3), .Y2(B_PLEXER_DECODER20_y2),
    .Y1(B_PLEXER_DECODER20_y1), .Y0(B_PLEXER_DECODER20_y0));
  My_24_decoder inst45 (.I1(uIR1), .I0(uIR0), .Y3(inst45_y3), .Y2(inst45_y2), .Y1(inst45_y1));  // open: Y0
  and inst43 (inst43_out, inst29_out, inst24_y4);
  My_8_bit_register IR (
    .CP(inst43_out), .d7(RZ_q7), .d6(RZ_q6), .d5(RZ_q5), .d4(RZ_q4), .d3(RZ_q3), .d2(RZ_q2), .d1(RZ_q1),
    .d0(RZ_q0), .q7(IR_q7), .q6(IR_q6), .q5(IR_q5), .q4(IR_q4), .q3(IR_q3), .q2(IR_q2), .q1(IR_q1), .q0(IR_q0));
  My_8_bit_double_plexer \QJP/JP  (
    .AY(inst45_y1), .BY(inst45_y2), .A7(1'b0), .B7(IR_q7), .A6(1'b0), .B6(IR_q6), .A5(1'b0), .B5(IR_q5),
    .A4(1'b0), .B4(IR_q4), .A3(1'b0), .B3(1'b0), .A2(1'b0), .B2(1'b0), .A1(1'b0), .B1(1'b0), .A0(1'b0),
    .B0(1'b0), .Y7(QJP_JP_y7), .Y6(QJP_JP_y6), .Y5(QJP_JP_y5), .Y4(QJP_JP_y4), .Y3(QJP_JP_y3),
    .Y2(QJP_JP_y2), .Y1(QJP_JP_y1), .Y0(QJP_JP_y0));
  and inst44 (inst44_out, inst29_out, inst24_y3);
  My_8_bit_register MAR (
    .CP(inst44_out), .d7(RZ_q7), .d6(RZ_q6), .d5(RZ_q5), .d4(RZ_q4), .d3(RZ_q3), .d2(RZ_q2), .d1(RZ_q1),
    .d0(RZ_q0), .q7(RAM_ADDRESS7), .q6(RAM_ADDRESS6), .q5(RAM_ADDRESS5), .q4(RAM_ADDRESS4),
    .q3(RAM_ADDRESS3), .q2(RAM_ADDRESS2), .q1(RAM_ADDRESS1), .q0(RAM_ADDRESS0));
  and inst55 (inst55_out, inst29_out, inst24_y2);

  assign uRD = 1'b0;
  assign WRY = uIR2;

  // Notes on the sheet:
  //   Y0: CPRZ
  //   Y2: CPMDR
  //   Y3:  CPMAR
  //   Y4: CPIR
  //   Y5 CPX
  //   Y6: CPR
  //   Y7: CPPC
  //   时钟脉冲
  //   平时不需要+1时，c0=1
  //   需要根据symbol+1了，c0=0
  //   如果symbol=0，那么自增
  //   symbol=1,不自增
  //   CPZ相等为1
  //   S0-S3一直是1001开着
  //   不相等为0
  //   关键在于有时候商要上商0或1然后再左移
  //   余数为正上商1，假设余数是B选择器选出来的，那么要把B选择器高位输出连过来
  //   数据总线
  //   原码加减 交替法要在余数为正时减除数
  //   平时控制信号关着，无论B7送什么都是直送
  //   需要送余数和除数进ALU时控制信号开
  //   此时若B7=0，则走求补
endmodule
